# EAGLE schematic Pure Sequencer (EAGLE 8.7.0)
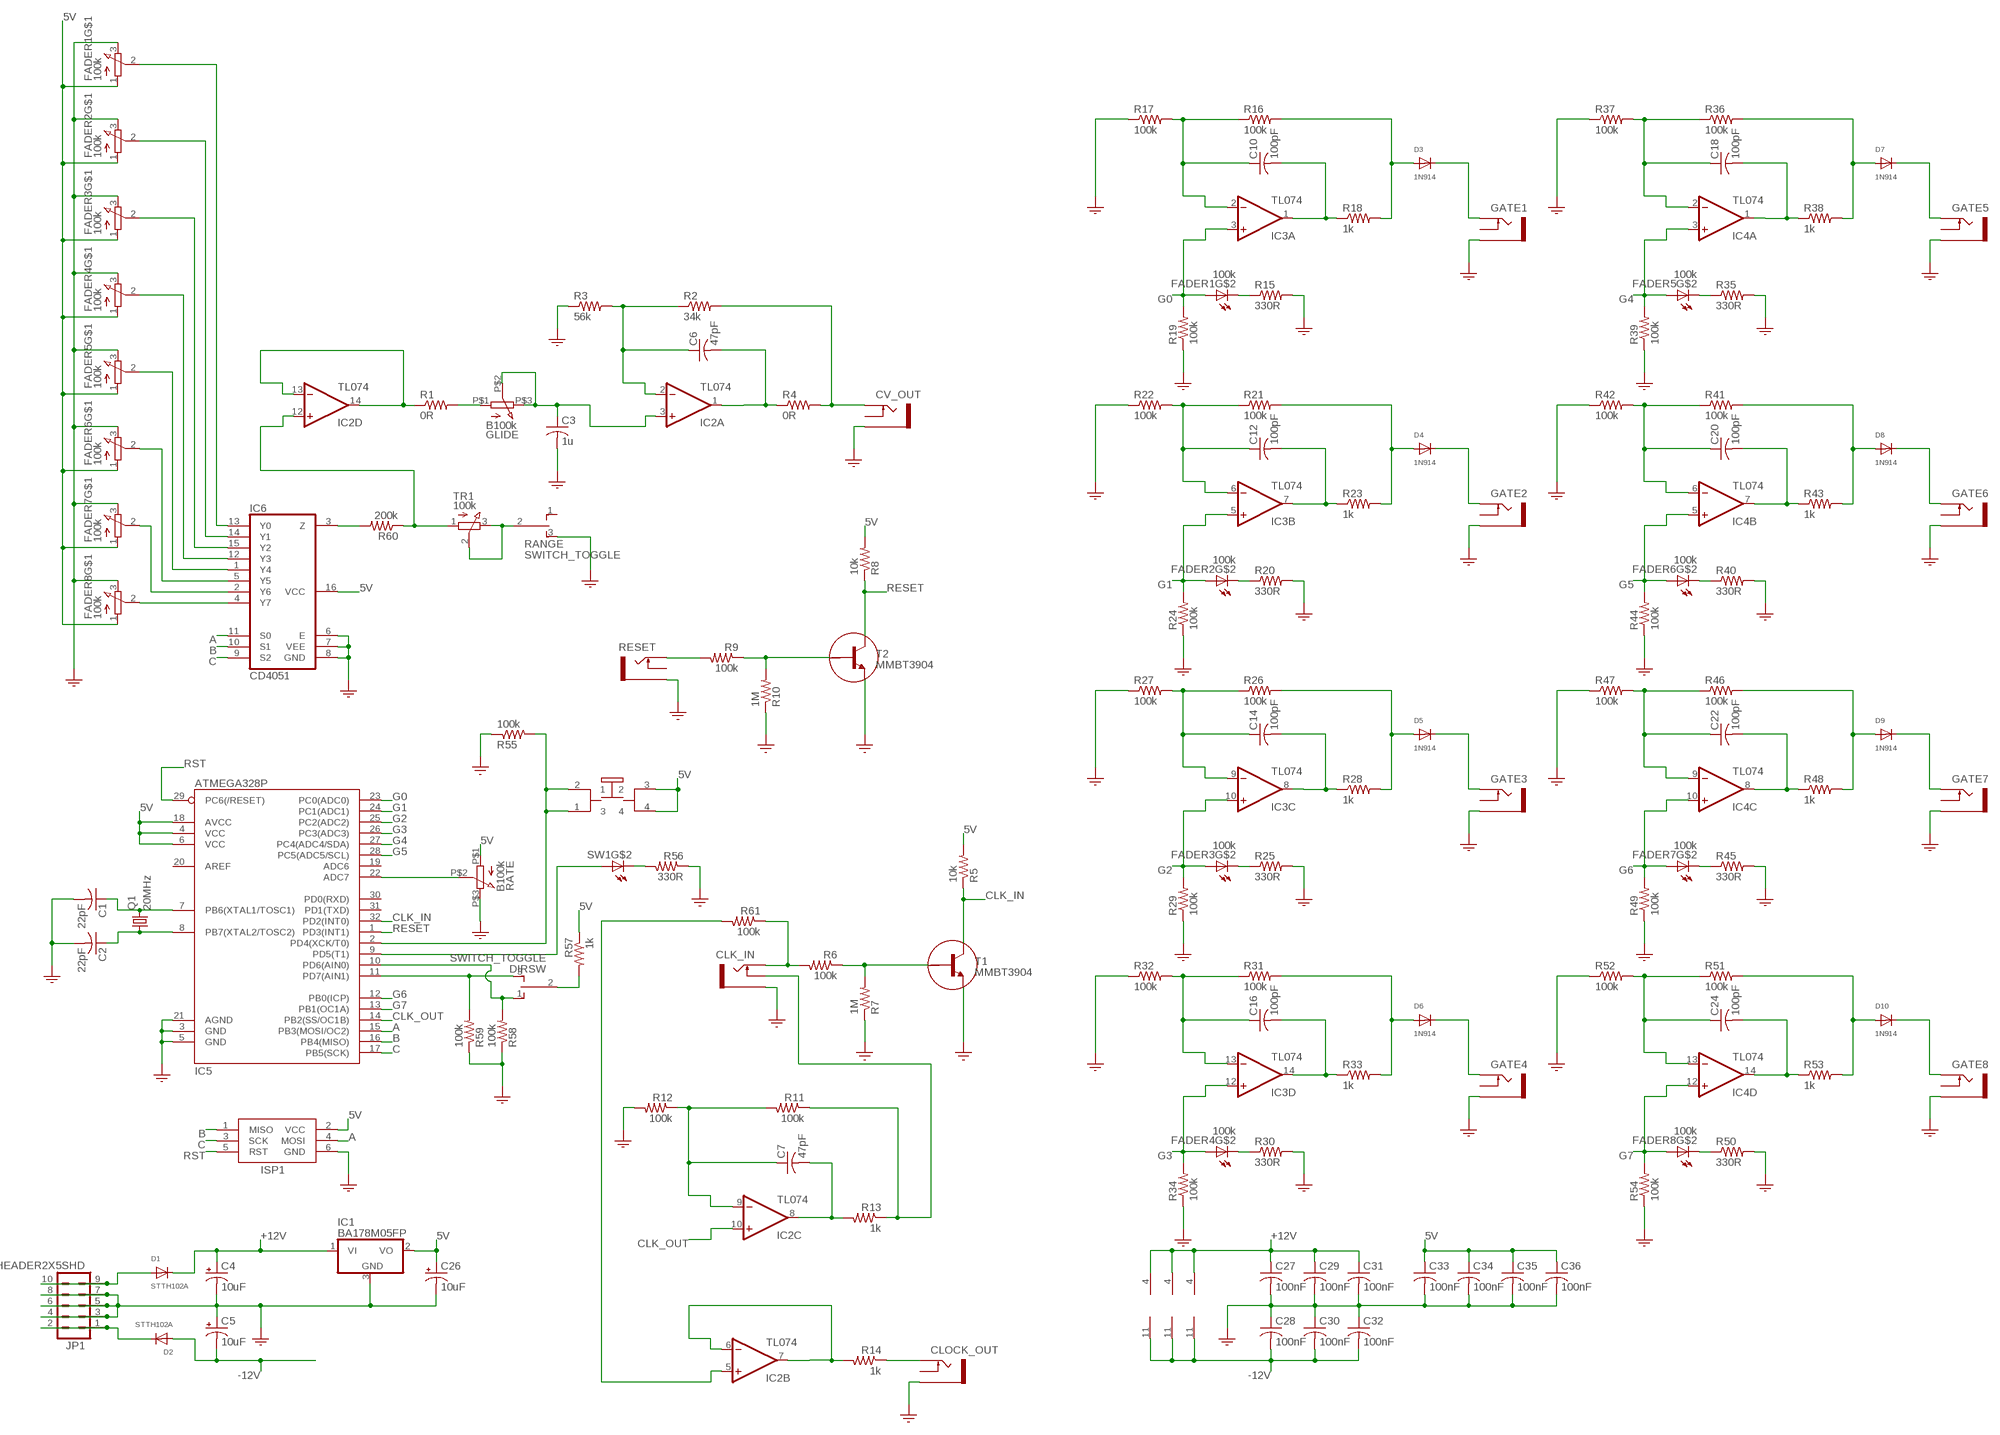
[diagram p0: schematic, sheet 1]

## Parts
C1  22pF  CAPACITOR-USC0805  [C0805]
C2  22pF  CAPACITOR-USC0805  [C0805]
C3  1u  CAPACITOR-USC0805  [C0805]
C4  10uF  CAPACITOR_POL-US153CLV-0505  [153CLV-0505]
C5  10uF  CAPACITOR_POL-US153CLV-0505  [153CLV-0505]
C6  47pF  CAPACITOR-USC0805  [C0805]
C7  47pF  CAPACITOR-USC0805  [C0805]
C10  100pF  CAPACITOR-USC0805  [C0805]
C12  100pF  CAPACITOR-USC0805  [C0805]
C14  100pF  CAPACITOR-USC0805  [C0805]
C16  100pF  CAPACITOR-USC0805  [C0805]
C18  100pF  CAPACITOR-USC0805  [C0805]
C20  100pF  CAPACITOR-USC0805  [C0805]
C22  100pF  CAPACITOR-USC0805  [C0805]
C24  100pF  CAPACITOR-USC0805  [C0805]
C26  10uF  CAPACITOR_POL-US153CLV-0505  [153CLV-0505]
C27  100nF  CAPACITOR-USC0805  [C0805]
C28  100nF  CAPACITOR-USC0805  [C0805]
C29  100nF  CAPACITOR-USC0805  [C0805]
C30  100nF  CAPACITOR-USC0805  [C0805]
C31  100nF  CAPACITOR-USC0805  [C0805]
C32  100nF  CAPACITOR-USC0805  [C0805]
C33  100nF  CAPACITOR-USC0805  [C0805]
C34  100nF  CAPACITOR-USC0805  [C0805]
C35  100nF  CAPACITOR-USC0805  [C0805]
C36  100nF  CAPACITOR-USC0805  [C0805]
CLK_IN  PJ301M-12  SOCKET_MONO_3.5MMPJ301M-12  [PJ301M-12]
CLOCK_OUT  PJ301M-12  SOCKET_MONO_3.5MMPJ301M-12  [PJ301M-12]
CV_OUT  PJ301M-12  SOCKET_MONO_3.5MMPJ301M-12  [PJ301M-12]
D1  STTH102A  DIODESMA  [SMADIODE]
D2  STTH102A  DIODESMA  [SMADIODE]
D3  1N914  DIODEDO-41  [DO-41]
D4  1N914  DIODEDO-41  [DO-41]
D5  1N914  DIODEDO-41  [DO-41]
D6  1N914  DIODEDO-41  [DO-41]
D7  1N914  DIODEDO-41  [DO-41]
D8  1N914  DIODEDO-41  [DO-41]
D9  1N914  DIODEDO-41  [DO-41]
D10  1N914  DIODEDO-41  [DO-41]
DIRSW  SWITCH_TOGGLE  [TOGGLE_SW]
FADER1  100k  RESISTOR_VARIABLE_LED  [FADER_20MM_LED]
FADER2  100k  RESISTOR_VARIABLE_LED  [FADER_20MM_LED]
FADER3  100k  RESISTOR_VARIABLE_LED  [FADER_20MM_LED]
FADER4  100k  RESISTOR_VARIABLE_LED  [FADER_20MM_LED]
FADER5  100k  RESISTOR_VARIABLE_LED  [FADER_20MM_LED]
FADER6  100k  RESISTOR_VARIABLE_LED  [FADER_20MM_LED]
FADER7  100k  RESISTOR_VARIABLE_LED  [FADER_20MM_LED]
FADER8  100k  RESISTOR_VARIABLE_LED  [FADER_20MM_LED]
GATE1  PJ301M-12  SOCKET_MONO_3.5MMPJ301M-12  [PJ301M-12]
GATE2  PJ301M-12  SOCKET_MONO_3.5MMPJ301M-12  [PJ301M-12]
GATE3  PJ301M-12  SOCKET_MONO_3.5MMPJ301M-12  [PJ301M-12]
GATE4  PJ301M-12  SOCKET_MONO_3.5MMPJ301M-12  [PJ301M-12]
GATE5  PJ301M-12  SOCKET_MONO_3.5MMPJ301M-12  [PJ301M-12]
GATE6  PJ301M-12  SOCKET_MONO_3.5MMPJ301M-12  [PJ301M-12]
GATE7  PJ301M-12  SOCKET_MONO_3.5MMPJ301M-12  [PJ301M-12]
GATE8  PJ301M-12  SOCKET_MONO_3.5MMPJ301M-12  [PJ301M-12]
GLIDE  B100k  RESISTOR_VARIABLE9MM_POT  [POTENTIOMETER_9MM]
IC1  BA178M05FP  VOLTAGE_REG_POS05DT  [TO252]
IC2  TL074  OPAMP_QUADD  [SO14]
IC3  TL074  OPAMP_QUADD  [SO14]
IC4  TL074  OPAMP_QUADD  [SO14]
IC5  ATMEGA328P  MICROPROCESSOR_ATMEGA328_SMT  [TQFP32-08]
IC6  CD4051  MUX_1X8_CD4051  [SOIC_16]
ISP1  HEADER2X3-6  [AVRISP]
JP1  HEADER2X5SHD  [2X5-SHROUDED]
Q1  20MHz  CRYSTALHC49UP  [HC49UP]
R1  0R  RESISTOR_USR0805  [R0805]
R2  34k  RESISTOR_USR0805  [R0805]
R3  56k  RESISTOR_USR0805  [R0805]
R4  0R  RESISTOR_USR0805  [R0805]
R5  10k  RESISTOR_USR0805  [R0805]
R6  100k  RESISTOR_USR0805  [R0805]
R7  1M  RESISTOR_USR0805  [R0805]
R8  10k  RESISTOR_USR0805  [R0805]
R9  100k  RESISTOR_USR0805  [R0805]
R10  1M  RESISTOR_USR0805  [R0805]
R11  100k  RESISTOR_USR0805  [R0805]
R12  100k  RESISTOR_USR0805  [R0805]
R13  1k  RESISTOR_USR0805  [R0805]
R14  1k  RESISTOR_USR0805  [R0805]
R15  330R  RESISTOR_USR0805  [R0805]
R16  100k  RESISTOR_USR0805  [R0805]
R17  100k  RESISTOR_USR0805  [R0805]
R18  1k  RESISTOR_USR0805  [R0805]
R19  100k  RESISTOR_USR0805  [R0805]
R20  330R  RESISTOR_USR0805  [R0805]
R21  100k  RESISTOR_USR0805  [R0805]
R22  100k  RESISTOR_USR0805  [R0805]
R23  1k  RESISTOR_USR0805  [R0805]
R24  100k  RESISTOR_USR0805  [R0805]
R25  330R  RESISTOR_USR0805  [R0805]
R26  100k  RESISTOR_USR0805  [R0805]
R27  100k  RESISTOR_USR0805  [R0805]
R28  1k  RESISTOR_USR0805  [R0805]
R29  100k  RESISTOR_USR0805  [R0805]
R30  330R  RESISTOR_USR0805  [R0805]
R31  100k  RESISTOR_USR0805  [R0805]
R32  100k  RESISTOR_USR0805  [R0805]
R33  1k  RESISTOR_USR0805  [R0805]
R34  100k  RESISTOR_USR0805  [R0805]
R35  330R  RESISTOR_USR0805  [R0805]
R36  100k  RESISTOR_USR0805  [R0805]
R37  100k  RESISTOR_USR0805  [R0805]
R38  1k  RESISTOR_USR0805  [R0805]
R39  100k  RESISTOR_USR0805  [R0805]
R40  330R  RESISTOR_USR0805  [R0805]
R41  100k  RESISTOR_USR0805  [R0805]
R42  100k  RESISTOR_USR0805  [R0805]
R43  1k  RESISTOR_USR0805  [R0805]
R44  100k  RESISTOR_USR0805  [R0805]
R45  330R  RESISTOR_USR0805  [R0805]
R46  100k  RESISTOR_USR0805  [R0805]
R47  100k  RESISTOR_USR0805  [R0805]
R48  1k  RESISTOR_USR0805  [R0805]
R49  100k  RESISTOR_USR0805  [R0805]
R50  330R  RESISTOR_USR0805  [R0805]
R51  100k  RESISTOR_USR0805  [R0805]
R52  100k  RESISTOR_USR0805  [R0805]
R53  1k  RESISTOR_USR0805  [R0805]
R54  100k  RESISTOR_USR0805  [R0805]
R55  100k  RESISTOR_USR0805  [R0805]
R56  330R  RESISTOR_USR0805  [R0805]
R57  1k  RESISTOR_USR0805  [R0805]
R58  100k  RESISTOR_USR0805  [R0805]
R59  100k  RESISTOR_USR0805  [R0805]
R60  200k  RESISTOR_USR0805  [R0805]
R61  100k  RESISTOR_USR0805  [R0805]
RANGE  SWITCH_TOGGLE  [TOGGLE_SW]
RATE  B100k  RESISTOR_VARIABLE9MM_POT  [POTENTIOMETER_9MM]
RESET  PJ301M-12  SOCKET_MONO_3.5MMPJ301M-12  [PJ301M-12]
SW1  SWITCH_PUSHBUTTON_LED  [PB6149L]
T1  MMBT3904  TRANSISTOR_NPNSOT23  [SOT23]
T2  MMBT3904  TRANSISTOR_NPNSOT23  [SOT23]
TR1  100k  RESISTOR_VARIABLETRIMMER_TH  [TRIMMER_TH]

## Nets
5V: C26.+ C33.1 C34.1 C35.1 C36.1 FADER1.1 FADER2.1 FADER3.1 FADER4.1 FADER5.1 FADER6.1 FADER7.1 FADER8.1 IC1.2(VO) IC5.4(VCC) IC5.6(VCC) IC5.18(AVCC) IC6.16(VCC) ISP1.2(VCC) R5.2 R8.2 R57.1 RATE.P$1 SW1.3 SW1.4
+12V: C4.+ C27.1 C29.1 C31.1 D1.C IC1.1(VI) IC2.4(P:V+) IC3.4(P:V+) IC4.4(P:V+)
-12V: C5.- C28.2 C30.2 C32.2 D2.A IC2.11(P:V-) IC3.11(P:V-) IC4.11(P:V-)
A: IC5.15(PB3(MOSI/OC2)) IC6.11(S0) ISP1.4(MOSI)
B: IC5.16(PB4(MISO)) IC6.10(S1) ISP1.1(MISO)
C: IC5.17(PB5(SCK)) IC6.9(S2) ISP1.3(SCK)
CLK_IN: IC5.32(PD2(INT0)) R5.1 T1.3(C)
CLK_OUT: IC2.10(C:+IN) IC5.14(PB2(SS/OC1B))
G0: FADER1.A IC3.3(A:+IN) IC5.23(PC0(ADC0)) R19.2
G1: FADER2.A IC3.5(B:+IN) IC5.24(PC1(ADC1)) R24.2
G2: FADER3.A IC3.10(C:+IN) IC5.25(PC2(ADC2)) R29.2
G3: FADER4.A IC3.12(D:+IN) IC5.26(PC3(ADC3)) R34.2
G4: FADER5.A IC4.3(A:+IN) IC5.27(PC4(ADC4/SDA)) R39.2
G5: FADER6.A IC4.5(B:+IN) IC5.28(PC5(ADC5/SCL)) R44.2
G6: FADER7.A IC4.10(C:+IN) IC5.12(PB0(ICP)) R49.2
G7: FADER8.A IC4.12(D:+IN) IC5.13(PB1(OC1A)) R54.2
GND: C1.2 C2.2 C3.2 C4.- C5.+ C26.- C27.2 C28.1 C29.2 C30.1 C31.2 C32.1 C33.2 C34.2 C35.2 C36.2 CLK_IN.GND(SLEEVE) CLOCK_OUT.GND(SLEEVE) CV_OUT.GND(SLEEVE) FADER1.3 FADER2.3 FADER3.3 FADER4.3 FADER5.3 FADER6.3 FADER7.3 FADER8.3 GATE1.GND(SLEEVE) GATE2.GND(SLEEVE) GATE3.GND(SLEEVE) GATE4.GND(SLEEVE) GATE5.GND(SLEEVE) GATE6.GND(SLEEVE) GATE7.GND(SLEEVE) GATE8.GND(SLEEVE) IC1.3(GND) IC5.3(GND) IC5.5(GND) IC5.21(AGND) IC6.6(E) IC6.7(VEE) IC6.8(GND) ISP1.6(GND) JP1.3 JP1.4 JP1.5 JP1.6 JP1.7 JP1.8 R3.1 R7.1 R10.1 R12.2 R15.2 R17.1 R19.1 R20.2 R22.1 R24.1 R25.2 R27.1 R29.1 R30.2 R32.1 R34.1 R35.2 R37.1 R39.1 R40.2 R42.1 R44.1 R45.2 R47.1 R49.1 R50.2 R52.1 R54.1 R55.1 R56.1 R58.1 R59.1 RANGE.3(S) RATE.P$3 RESET.GND(SLEEVE) T1.2(E) T2.2(E)
N$1: C1.1 IC5.7(PB6(XTAL1/TOSC1)) Q1.2
N$2: C2.1 IC5.8(PB7(XTAL2/TOSC2)) Q1.1
N$3: IC2.12(D:+IN) R60.1 TR1.1
N$4: IC2.13(D:-IN) IC2.14(D:OUT) R1.1
N$5: GLIDE.P$1 R1.2
N$6: FADER8.2 IC6.4(Y7)
N$7: FADER7.2 IC6.2(Y6)
N$8: FADER6.2 IC6.5(Y5)
N$9: D1.A JP1.9 JP1.10
N$10: D2.C JP1.1 JP1.2
N$11: FADER5.2 IC6.1(Y4)
N$12: FADER4.2 IC6.12(Y3)
N$13: FADER3.2 IC6.15(Y2)
N$14: FADER2.2 IC6.14(Y1)
N$15: FADER1.2 IC6.13(Y0)
N$16: C3.1 GLIDE.P$2 GLIDE.P$3 IC2.3(A:+IN)
N$17: R6.1 R7.2 T1.1(B)
N$18: IC2.5(B:+IN) R61.2
N$19: C6.1 IC2.2(A:-IN) R2.1 R3.2
N$20: C6.2 IC2.1(A:OUT) R4.1
N$21: CV_OUT.TIP R2.2 R4.2
N$22: R9.1 R10.2 T2.1(B)
N$23: R9.2 RESET.TIP
N$24: C7.1 IC2.9(C:-IN) R11.2 R12.1
N$25: C7.2 IC2.8(C:OUT) R13.2
N$26: CLK_IN.TIP R6.2 R61.1
N$27: IC2.6(B:-IN) IC2.7(B:OUT) R14.2
N$28: CLOCK_OUT.TIP R14.1
N$29: CLK_IN.NORM(SWITCH) R11.1 R13.1
N$30: IC5.22(ADC7) RATE.P$2
N$31: FADER1.K(C) R15.1
N$32: C10.1 IC3.2(A:-IN) R16.1 R17.2
N$33: C10.2 IC3.1(A:OUT) R18.1
N$34: D3.A R16.2 R18.2
N$35: FADER3.K(C) R25.1
N$36: FADER2.K(C) R20.1
N$37: C12.1 IC3.6(B:-IN) R21.1 R22.2
N$38: C12.2 IC3.7(B:OUT) R23.1
N$39: D4.A R21.2 R23.2
N$40: C14.1 IC3.9(C:-IN) R26.1 R27.2
N$41: C14.2 IC3.8(C:OUT) R28.1
N$42: D5.A R26.2 R28.2
N$43: FADER4.K(C) R30.1
N$44: C16.1 IC3.13(D:-IN) R31.1 R32.2
N$45: C16.2 IC3.14(D:OUT) R33.1
N$46: D6.A R31.2 R33.2
N$47: FADER5.K(C) R35.1
N$48: C18.1 IC4.2(A:-IN) R36.1 R37.2
N$49: C18.2 IC4.1(A:OUT) R38.1
N$50: D7.A R36.2 R38.2
N$51: FADER6.K(C) R40.1
N$52: C20.1 IC4.6(B:-IN) R41.1 R42.2
N$53: C20.2 IC4.7(B:OUT) R43.1
N$54: D8.A R41.2 R43.2
N$55: FADER7.K(C) R45.1
N$56: C22.1 IC4.9(C:-IN) R46.1 R47.2
N$57: C22.2 IC4.8(C:OUT) R48.1
N$58: D9.A R46.2 R48.2
N$59: FADER8.K(C) R50.1
N$60: C24.1 IC4.13(D:-IN) R51.1 R52.2
N$61: C24.2 IC4.14(D:OUT) R53.1
N$62: D10.A R51.2 R53.2
N$63: IC5.2(PD4(XCK/T0)) R55.2 SW1.1 SW1.2
N$64: IC5.9(PD5(T1)) SW1.A
N$65: R56.2 SW1.K(C)
N$66: DIRSW.2(P) R57.2
N$67: DIRSW.1(O) IC5.10(PD6(AIN0)) R58.2
N$68: DIRSW.3(S) IC5.11(PD7(AIN1)) R59.2
N$69: IC6.3(Z) R60.2
N$70: RANGE.2(P) TR1.2 TR1.3
N$71: D6.C GATE4.TIP
N$72: D5.C GATE3.TIP
N$73: D4.C GATE2.TIP
N$74: D3.C GATE1.TIP
N$75: D10.C GATE8.TIP
N$76: D9.C GATE7.TIP
N$77: D8.C GATE6.TIP
N$78: D7.C GATE5.TIP
RESET: IC5.1(PD3(INT1)) R8.1 T2.3(C)
RST: IC5.29(PC6(/RESET)) ISP1.5(RST)
Unconnected: CLOCK_OUT.NORM(SWITCH) CV_OUT.NORM(SWITCH) GATE1.NORM(SWITCH) GATE2.NORM(SWITCH) GATE3.NORM(SWITCH) GATE4.NORM(SWITCH) GATE5.NORM(SWITCH) GATE6.NORM(SWITCH) GATE7.NORM(SWITCH) GATE8.NORM(SWITCH) IC5.19(ADC6) IC5.20(AREF) IC5.30(PD0(RXD)) IC5.31(PD1(TXD)) RANGE.1(O) RESET.NORM(SWITCH)

## Library data of the parts
C1-C3 C6 C7 C10 C12 C14 C16 C18 C20 C22 C24 C27-C36 = GMSN:CAPACITOR-US: Capacitor; SORT: 3
C4 C5 C26 = GMSN:CAPACITOR_POL-US: Electro Capacitor; SORT: 6
CLK_IN CLOCK_OUT CV_OUT GATE1-GATE8 RESET = GMSN:SOCKET_MONO_3.5MM: 3.5 mm Jack Socket; SORT: 8
D1-D10 = GMSN:DIODE: Diode SMADIODE - SMA Surface Mount Package 20V 1A Schottky Diode Digikey: 641-1014-6-ND DO-1N4148 - Through Hole Small Current Diode SOD-123 20V 1 A (.5mV Vf) Schottky Diode - Digikey: MBRX120TPMSCT-ND SOD-323 10V 570mA (.38mV Vf, 3ns) Schottky Diode - Digikey: ZLLS410CT-ND SOD-523 30V 30mA Schottky Diode (RB751S-40TE61) - Digikey: RB751S-40TE61CT-ND SOT23-R/W - SOT23 Package (R = Solder Paste/Reflow Ovens, W = Hand-Soldering) BAT54Film 40V 300mA - Digikey: 497-7162-1-ND; SORT: 1
DIRSW RANGE = GMSN:SWITCH_TOGGLE: On-Off-On Switch; SORT: 9
FADER1-FADER8 = GMSN:RESISTOR_VARIABLE_LED: Potentiometer with LED; SORT: 7
GLIDE RATE = GMSN:RESISTOR_VARIABLE: Potentiometer; SORT: 8
IC1 = GMSN:VOLTAGE_REG_POS: Positive Voltage Regulator Added bigger pads to the TO-92 package; SORT: 4
IC2-IC4 = GMSN:OPAMP_QUAD: OP AMP; SORT: 4
IC5 = GMSN:MICROPROCESSOR_ATMEGA328_SMT: 32-Pin ATMEGA328 Commonly used on Arduino compatible boards Available in QFP and QFN packages TQFP is IC-09069 QFN is non-stock; SORT: 4
IC6 = GMSN:MUX_1X8_CD4051: Multiplexer / Demultiplexer; SORT: 4
ISP1 = GMSN:HEADER2X3: AVR ISP Header Standard 6 pin header for AVR programming; SORT: 7
JP1 = GMSN:HEADER2X5: Header 5x2 Standard 10-pin dual row 0.1" header. Commonly used with AVR-ISP. Use with Spark Fun Electronics SKU: PRT-00778; SORT: 7
Q1 = GMSN:CRYSTAL: Crystal; SORT: 5
R1-R61 = GMSN:RESISTOR_US: Resistor; SORT: 2
SW1 = GMSN:SWITCH_PUSHBUTTON_LED: Pushbutton LED; SORT: 9
T1 T2 = GMSN:TRANSISTOR_NPN: Generic NPN BJT MMBT2222A - TRANS-08049 (SOT-23, 1A 40V) MPSA42 - TRANS-09116 (SOT-23, 500mA 300V) MMBT5088LT1G - TRANS-11160 (SOT-23, 50 mA 30V); SORT: 4
TR1 = GMSN:RESISTOR_VARIABLE: Potentiometer; SORT: 7